# EAGLE design io (EAGLE 4.16)
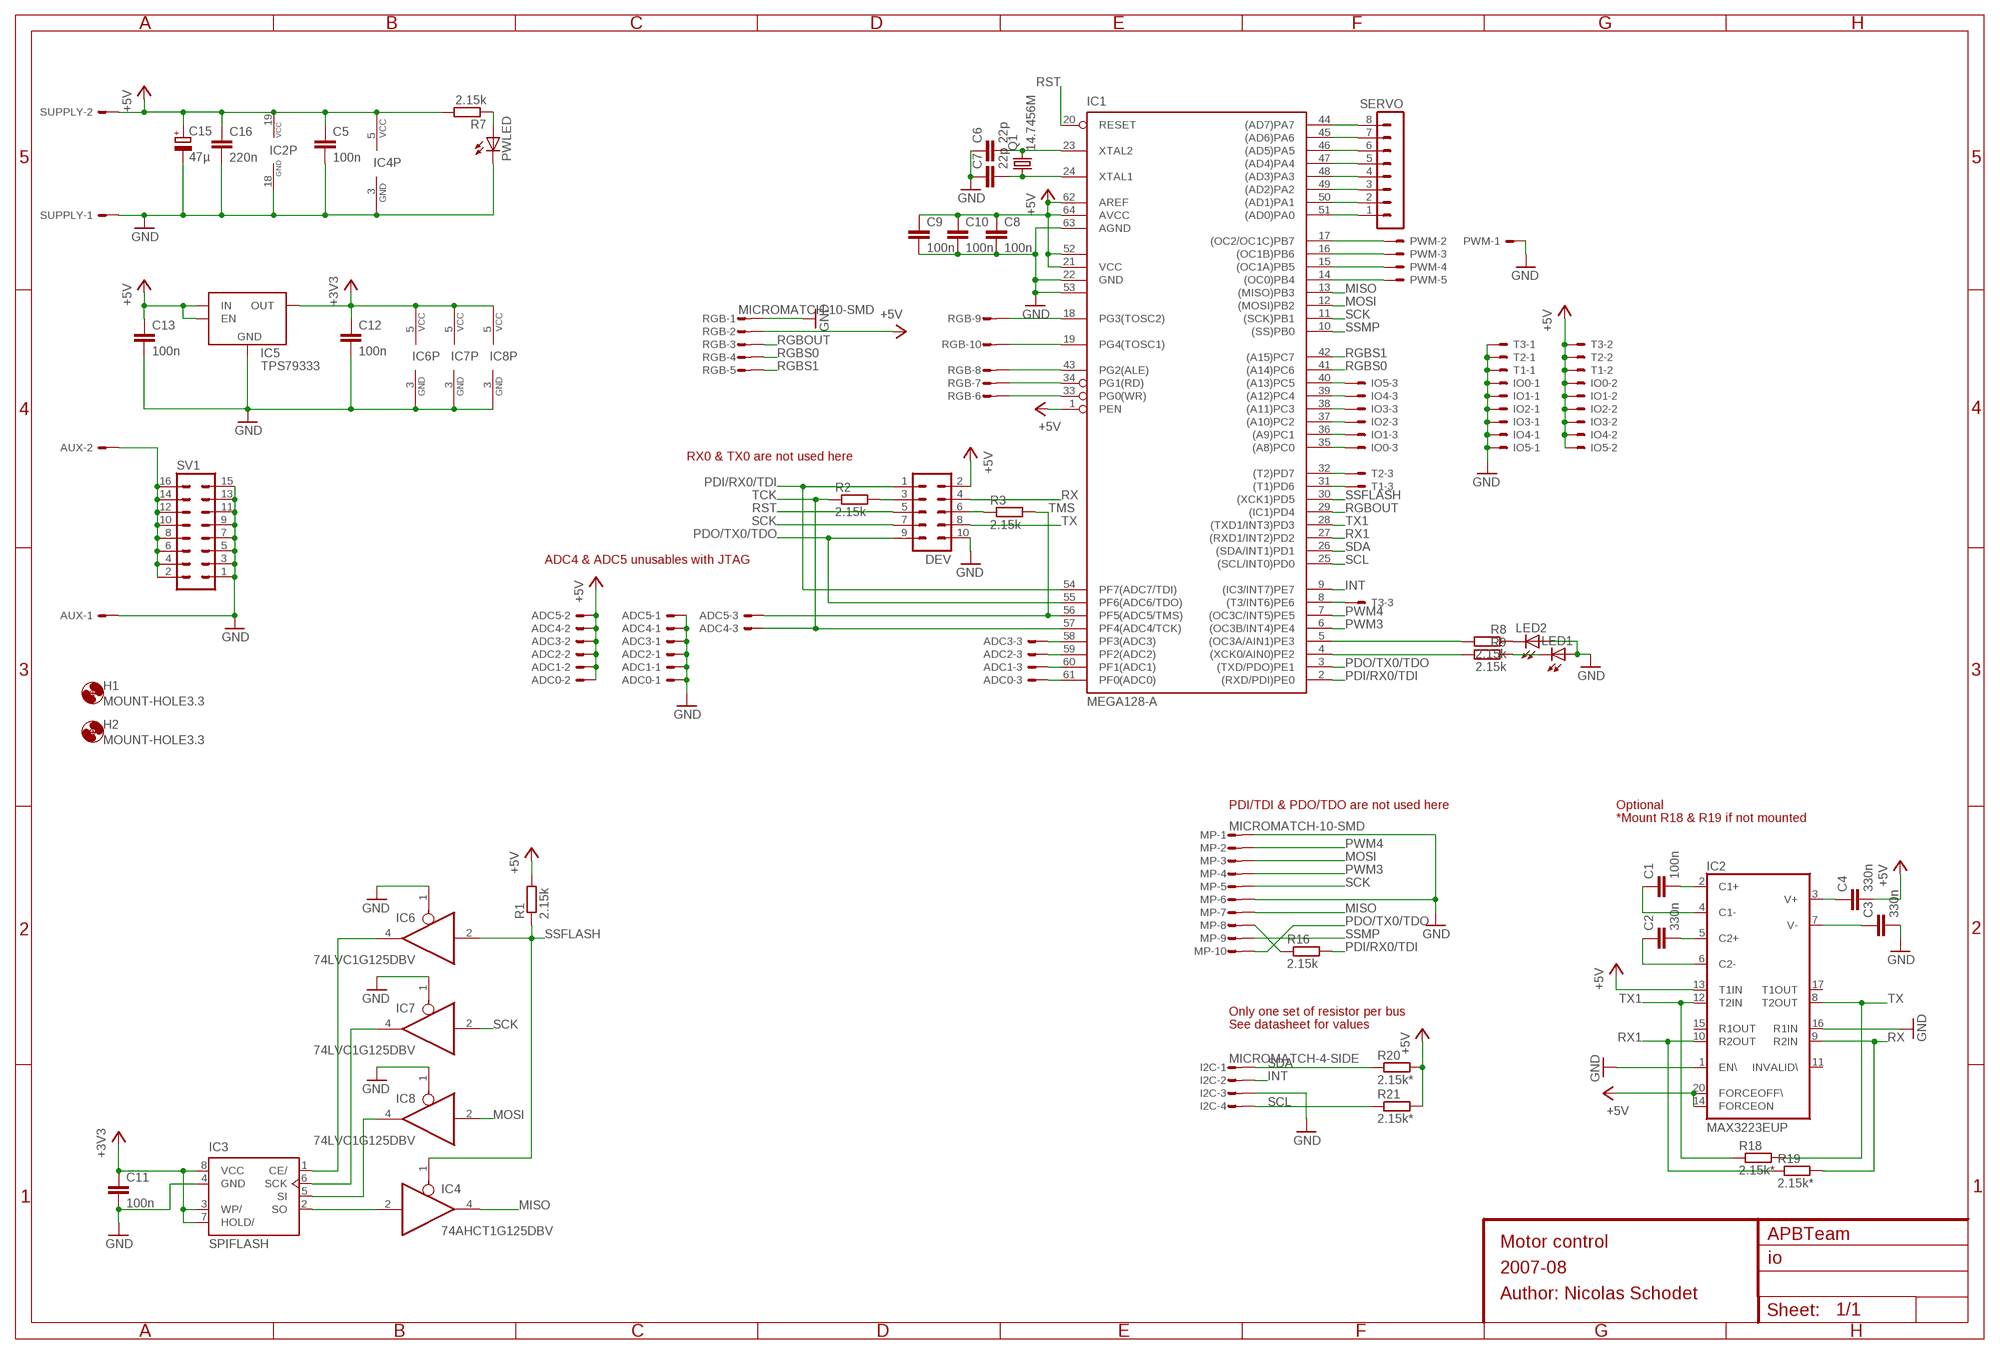
[diagram p0: schematic, sheet 1]

## Parts
ADC0  ED1X03  [ED1X03]
ADC1  ED1X03  [ED1X03]
ADC2  ED1X03  [ED1X03]
ADC3  ED1X03  [ED1X03]
ADC4  ED1X03  [ED1X03]
ADC5  ED1X03  [ED1X03]
AUX  EC1X02  [EC1X02]
C1  100n  C-EUC0603  [C0603]
C2  330n  C-EUC0603  [C0603]
C3  330n  C-EUC0603  [C0603]
C4  330n  C-EUC0603  [C0603]
C5  100n  C-EUC0603  [C0603]
C6  22p  C-EUC0603  [C0603]
C7  22p  C-EUC0603  [C0603]
C8  100n  C-EUC0603  [C0603]
C9  100n  C-EUC0603  [C0603]
C10  100n  C-EUC0603  [C0603]
C11  100n  C-EUC0603  [C0603]
C12  100n  C-EUC0603  [C0603]
C13  100n  C-EUC0603  [C0603]
C15  47µ  CPOL-EUC  [PANASONIC_C]
C16  220n  C-EUC0603  [C0603]
DEV  ML10L  [ML10L]
H1  MOUNT-HOLE3.3  [3,3]
H2  MOUNT-HOLE3.3  [3,3]
I2C  MICROMATCH-4-SIDE  [MICROMATCH-4-SIDE]
IC1  MEGA128-A  [TQFP64]
IC2  MAX3223EUP  [TSSOP20]
IC3  SPIFLASH  [SOIC8]
IC4  74AHCT1G125DBV  [SOT23-5]
IC5  TPS79333  [SOT23-5]
IC6  74LVC1G125DBV  [SOT23-5]
IC7  74LVC1G125DBV  [SOT23-5]
IC8  74LVC1G125DBV  [SOT23-5]
IO0  ED1X03  [ED1X03]
IO1  ED1X03  [ED1X03]
IO2  ED1X03  [ED1X03]
IO3  ED1X03  [ED1X03]
IO4  ED1X03  [ED1X03]
IO5  ED1X03  [ED1X03]
LED1  LEDSMT1206  [1206]
LED2  LEDSMT1206  [1206]
MP  MICROMATCH-10-SMD  [MICROMATCH-10-SMD]
PWLED  LEDSMT1206  [1206]
PWM  ED1X05  [ED1X05]
Q1  14.7456M  CRYTALHC49U70  [HC49U70]
R1  2.15k  R-EU_R0603  [R0603]
R2  2.15k  R-EU_R0603  [R0603]
R3  2.15k  R-EU_R0603  [R0603]
R7  2.15k  R-EU_R0603  [R0603]
R8  2.15k  R-EU_R0603  [R0603]
R9  2.15k  R-EU_R0603  [R0603]
R16  2.15k  R-EU_R0603  [R0603]
R18  2.15k*  R-EU_R0603  [R0603]
R19  2.15k*  R-EU_R0603  [R0603]
R20  2.15k*  R-EU_R0603  [R0603]
R21  2.15k*  R-EU_R0603  [R0603]
RGB  MICROMATCH-10-SMD  [MICROMATCH-10-SMD]
SERVO  MA08-1  [MA08-1]
SUPPLY  EC1X02  [EC1X02]
SV1  MA08-2  [MA08-2]
T1  ED1X03  [ED1X03]
T2  ED1X03  [ED1X03]
T3  ED1X03  [ED1X03]

## Nets
5VS: AUX.2 SV1.2 SV1.4 SV1.6 SV1.8 SV1.10 SV1.12 SV1.14 SV1.16
+3V3 [supply]: C11.1 C12.1 IC3.3(WP/) IC3.7(HOLD/) IC3.8(VCC) IC5.5(OUT) IC6.5(VCC) IC7.5(VCC) IC8.5(VCC)
+5V [supply]: ADC0.2 ADC1.2 ADC2.2 ADC3.2 ADC4.2 ADC5.2 C4.2 C5.1 C8.1 C9.1 C10.1 C13.1 C15.+ C16.1 DEV.2 IC1.1(PEN) IC1.21(VCC) IC1.52(VCC1) IC1.62(AREF) IC1.64(AVCC) IC2.13(T1IN) IC2.14(FORCEON) IC2.19(VCC) IC2.20(FORCEOFF\) IC4.5(VCC) IC5.1(IN) IC5.3(EN) IO0.2 IO1.2 IO2.2 IO3.2 IO4.2 IO5.2 R1.2 R7.2 R20.2 R21.2 RGB.2 SUPPLY.2 T1.2 T2.2 T3.2
AVRCLK: C6.2 IC1.23(XTAL2) Q1.2
GND [supply]: ADC0.1 ADC1.1 ADC2.1 ADC3.1 ADC4.1 ADC5.1 AUX.1 C3.2 C5.2 C6.1 C7.1 C8.2 C9.2 C10.2 C11.2 C12.2 C13.2 C15.- C16.2 DEV.10 I2C.3 IC1.22(GND) IC1.53(GND1) IC1.63(AGND) IC2.1(EN\) IC2.16(R1IN) IC2.18(GND) IC3.4(GND) IC4.3(GND) IC5.2(GND) IC6.1(OE) IC6.3(GND) IC7.1(OE) IC7.3(GND) IC8.1(OE) IC8.3(GND) IO0.1 IO1.1 IO2.1 IO3.1 IO4.1 IO5.1 LED1.A LED2.A MP.1 MP.6 PWLED.C PWM.1 RGB.1 SUPPLY.1 SV1.1 SV1.3 SV1.5 SV1.7 SV1.9 SV1.11 SV1.13 SV1.15 T1.1 T2.1 T3.1
INT: I2C.2 IC1.9((IC3/INT7)PE7)
IO0: IC1.35((A8)PC0) IO0.3
IO1: IC1.36((A9)PC1) IO1.3
IO2: IC1.37((A10)PC2) IO2.3
IO3: IC1.38((A11)PC3) IO3.3
IO4: IC1.39((A12)PC4) IO4.3
IO5: IC1.40((A13)PC5) IO5.3
MC1+: C1.2 IC2.2(C1+)
MC1-: C1.1 IC2.4(C1-)
MC2+: C2.2 IC2.5(C2+)
MC2-: C2.1 IC2.6(C2-)
MISO: IC1.13((MISO)PB3) IC4.4(O) MP.7
MOSI: IC1.12((MOSI)PB2) IC8.2(I) MP.3
MV+: C4.1 IC2.3(V+)
MV-: C3.1 IC2.7(V-)
N$1: PWLED.A R7.1
N$4: IC1.17((OC2/OC1C)PB7) PWM.2
N$5: IC1.16((OC1B)PB6) PWM.3
N$6: IC1.15((OC1A)PB5) PWM.4
N$7: IC1.14((OC0)PB4) PWM.5
N$8: ADC0.3 IC1.61(PF0(ADC0))
N$9: ADC1.3 IC1.60(PF1(ADC1))
N$10: ADC2.3 IC1.59(PF2(ADC2))
N$11: C7.2 IC1.24(XTAL1) Q1.1
N$12: ADC3.3 IC1.58(PF3(ADC3))
N$13: DEV.3 R2.2
N$14: LED2.C R8.1
N$15: IC1.51((AD0)PA0) SERVO.1
N$16: LED1.C R9.1
N$17: IC1.50((AD1)PA1) SERVO.2
N$18: IC1.49((AD2)PA2) SERVO.3
N$19: IC1.48((AD3)PA3) SERVO.4
N$20: IC1.47((AD4)PA4) SERVO.5
N$21: IC1.46((AD5)PA5) SERVO.6
N$22: IC1.45((AD6)PA6) SERVO.7
N$23: IC1.44((AD7)PA7) SERVO.8
N$24: IC3.2(SO) IC4.2(I)
N$25: IC3.5(SI) IC8.4(O)
N$26: IC3.6(SCK) IC7.4(O)
N$27: IC3.1(CE/) IC6.4(O)
N$28: DEV.6 R3.1
N$29: IC1.5((OC3A/AIN1)PE3) R8.2
N$30: IC1.4((XCK0/AIN0)PE2) R9.2
PDI/RX0/TDI: DEV.1 IC1.2((RXD/PDI)PE0) IC1.54(PF7(ADC7/TDI)) R16.2
PDO/TX0/TDO: DEV.9 IC1.3((TXD/PDO)PE1) IC1.55(PF6(ADC6/TDO)) MP.10
PWM3: IC1.6((OC3B/INT4)PE4) MP.4
PWM4: IC1.7((OC3C/INT5)PE5) MP.2
RGBEN0: IC1.33(PG0(WR)) RGB.6
RGBEN1: IC1.34(PG1(RD)) RGB.7
RGBEN2: IC1.43(PG2(ALE)) RGB.8
RGBEN3: IC1.18(PG3(TOSC2)) RGB.9
RGBEN4: IC1.19(PG4(TOSC1)) RGB.10
RGBOUT: IC1.29((IC1)PD4) RGB.3
RGBS0: IC1.41((A14)PC6) RGB.4
RGBS1: IC1.42((A15)PC7) RGB.5
RST: DEV.5 IC1.20(RESET)
RX: DEV.4 IC2.9(R2IN) R19.2
RX1: IC1.27((RXD1/INT2)PD2) IC2.10(R2OUT) R19.1
SCK: DEV.7 IC1.11((SCK)PB1) IC7.2(I) MP.5
SCL: I2C.4 IC1.25((SCL/INT0)PD0) R21.1
SDA: I2C.1 IC1.26((SDA/INT1)PD1) R20.1
SSFLASH: IC1.30((XCK1)PD5) IC4.1(OE) IC6.2(I) R1.1
SSMP: IC1.10((SS)PB0) MP.9
T1: IC1.31((T1)PD6) T1.3
T2: IC1.32((T2)PD7) T2.3
T3: IC1.8((T3/INT6)PE6) T3.3
TCK: ADC4.3 IC1.57(PF4(ADC4/TCK)) R2.1
TMS: ADC5.3 IC1.56(PF5(ADC5/TMS)) R3.2
TX: DEV.8 IC2.8(T2OUT) R18.2
TX1: IC1.28((TXD1/INT3)PD3) IC2.12(T2IN) R18.1
TX_SLAVE: MP.8 R16.1
Unconnected: IC2.11(INVALID\) IC2.15(R1OUT) IC2.17(T1OUT)

## Notes on the sheet
- RX0 & TX0 are not used here
- ADC4 & ADC5 unusables with JTAG
- PDI/TDI & PDO/TDO are not used here | Optional
- *Mount R18 & R19 if not mounted
- Only one set of resistor per bus
- See datasheet for values
- APBTeam
- Motor control
- 2007-08
- Author: Nicolas Schodet

## Library data of the parts
ADC0 ADC1-ADC5 IO0 IO1-IO5 T1-T3 = apbteam_con-amp-he14:E?1X03: Male header simple row, 3 positions
AUX SUPPLY = apbteam_con-amp-he14:E?1X02: Male header simple row, 2 positions
C1-C13 C16 = rcl:C-EU: CAPACITOR, European symbol
C15 = rcl:CPOL-EU: POLARIZED CAPACITOR, European symbol
DEV = con-harting-ml:ML10: HARTING
H1 H2 = holes:MOUNT-HOLE: MOUNTING HOLE with drill center marker
I2C = apbteam_con-amp-micromatch:MICROMATCH-4: MicroMaTch 4
IC1 = robot_avr:MEGA128: MICROCONTROLLER 128 Kbytes FLASH 4 Kbytes SRAM 4 Kbytes EEPROM DUAL USART 8-channel 10 bit ADC
IC2 = maxim:MAX3223*: RS-232 Transceivers with AutoShutdown 1µA Supply-Current, True +3V to +5.5V http://dbserv.maxim-ic.com/
IC3 = apbteam_spiflash:SPIFLASH
IC4 IC6-IC8 = 74xx-little-us:74*1G125: Single Bus Buffer Gate with 3-State Output
IC5 = apbteam_v-reg:TPS793*: Low-power 150 mA low-dropout linear regulator TPS763xx familly
LED1 LED2 PWLED = led:LED: LED OSRAM: - CHIPLED LG R971, LG N971, LY N971, LG Q971, LY Q971, LO R971, LY R971 LH N974, LH R974 LS Q976, LO Q976, LY Q976 LO Q996 - Hyper CHIPLED LW Q18S LB Q993, LB Q99A, LB R99A - SideLED LS A670, LO A670, LY A670, LG A670, LP A670 LB A673, LV A673, LT A673, LW A673 LH A674 LY A675 LS A676, LA A676, LO A676, LY A676, LW A676 LS A679, LY A679, LG A679 - Hyper Micro SIDELED® LS Y876, LA Y876, LO Y876, LY Y876 LT Y87S - SmartLED LW L88C, LW L88S LB L89C, LB L89S, LG L890 LS L89K, LO L89K, LY L89K LS L896, LA L896, LO L896, LY L896 - TOPLED LS T670, LO T670, LY T670, LG T670, LP T670 LSG T670, LSP T670, LSY T670, LOP T670, LYG T670 LG T671, LOG T671, LSG T671 LB T673, LV T673, LT T673, LW T673 LH T674 LS T676, LA T676, LO T676, LY T676, LB T676, LH T676, LSB T676, LW T676 LB T67C, LV T67C, LT T67C, LS T67K, LO T67K, LY T67K, LW E67C LS E67B, LA E67B, LO E67B, LY E67B, LB E67C, LV E67C, LT E67C LW T67C LS T679, LY T679, LG T679 LS T770, LO T770, LY T770, LG T770, LP T770 LB T773, LV T773, LT T773, LW T773 LH T774 LS E675, LA E675, LY E675, LS T675 LS T776, LA T776, LO T776, LY T776, LB T776 LHGB T686 LT T68C, LB T68C - Hyper Mini TOPLED® LB M676 - Mini TOPLED Santana® LG M470 LS M47K, LO M47K, LY M47K Source: http://www.osram.convergy.de/
MP RGB = apbteam_con-amp-micromatch:MICROMATCH-10: MicroMaTch 10
PWM = apbteam_con-amp-he14:E?1X05: Male header simple row, 5 positions
Q1 = crystal:CRYTAL: CRYSTAL
R1-R3 R7-R9 R16 R18-R21 = rcl:R-EU_: RESISTOR, European symbol
SERVO = con-lstb:MA08-1: PIN HEADER
SV1 = con-lstb:MA08-2: PIN HEADER

## Net classes
1 supply: width 0.254 mm

## Board
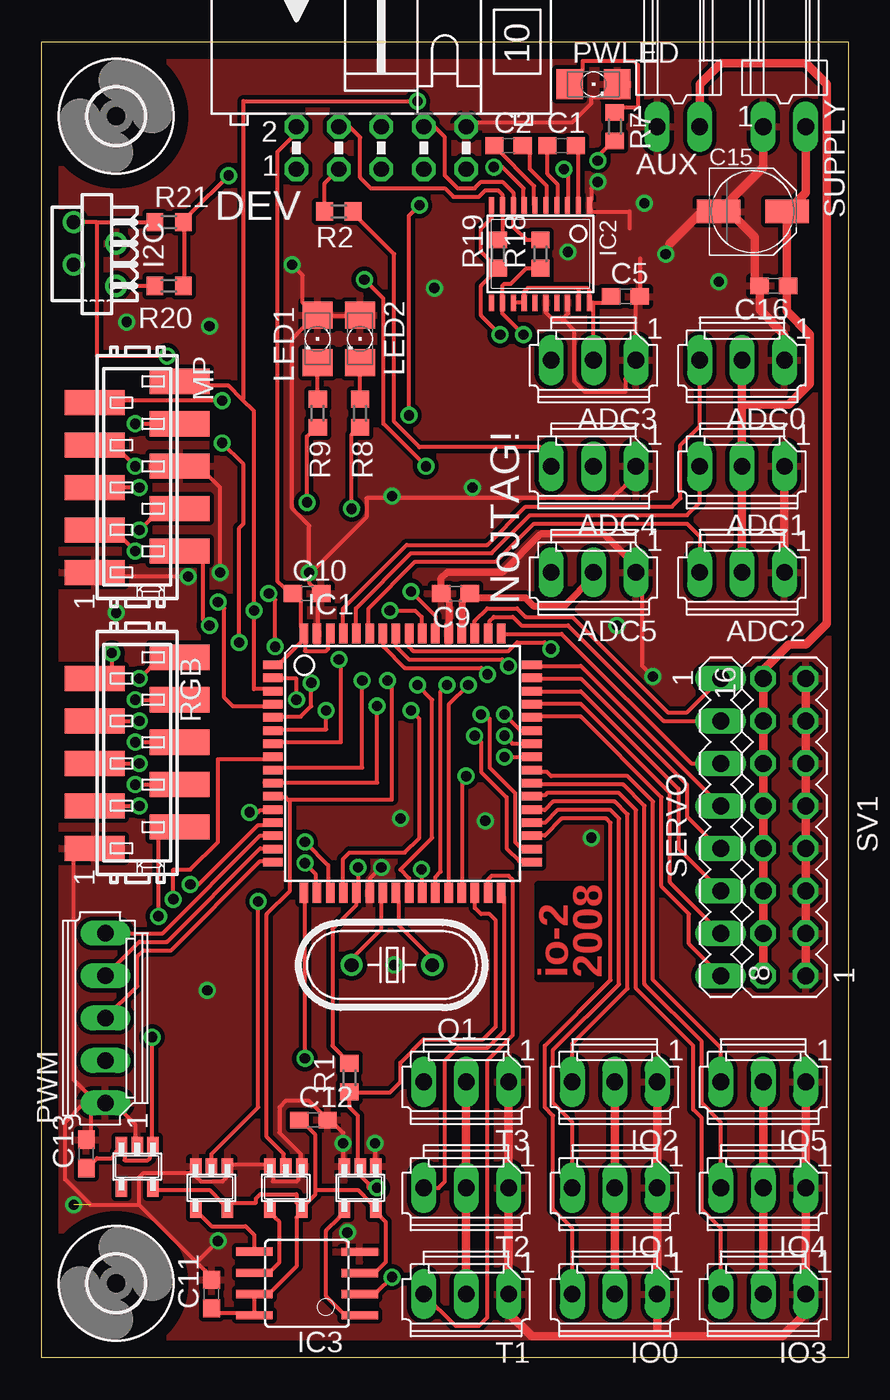
[diagram p1: board, top side]
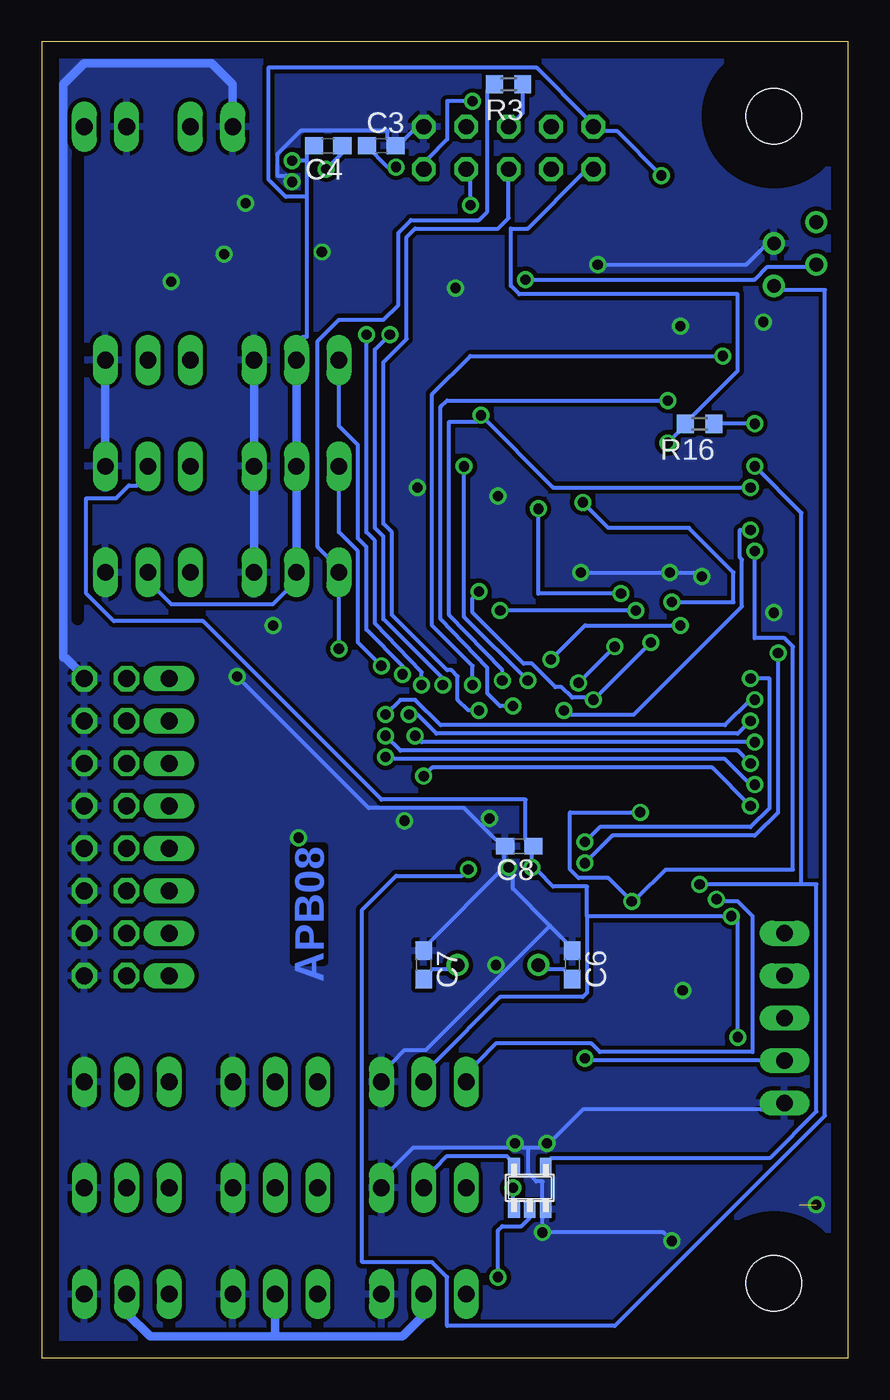
[diagram p2: board, bottom side, seen from below]

Size 48.26 x 78.74 mm. Coordinates in mm from the lower left corner, seen from the top.
Outline: 0,0 0,78.74 48.26,78.74 48.26,0 0,0
Copper layers (1*16): Top 0.035mm / dielectric 1.5mm / Bottom 0.035mm
Design rules "10mils": minimum track width 10mil, minimum drill 24mil, track to track 10mil, track to pad 10mil, pad to pad 10mil, via to via 10mil, smd to smd 10mil, copper to edge 40mil, drill to drill 10mil, minimum pad ring 10mil, minimum via ring 8mil, stop-mask expansion 0mil, vias tented up to drill 0mil, thermal gap 10mil
bRestrict: 1 lines

### Footprints (pad centres in the part's own frame; a part is rotated, then mirrored left to right if it is on the bottom)
ED1X03 = drill 1 long: 1 -2.54,0; 2 0,0; 3 2.54,0
EC1X02 = drill 1 long: 1 -1.27,0; 2 1.27,0
C0603 = smd 1.1 x 1: 1 -0.85,0; 2 0.85,0
PANASONIC_C = smd 2.6 x 1.4: + 2.05,0; - -2.05,0
ML10L = drill 0.914 octagon: 1 -5.08,-1.27; 2 -5.08,1.27; 3 -2.54,-1.27; 4 -2.54,1.27; 5 0,-1.27; 6 0,1.27; 7 2.54,-1.27; 8 2.54,1.27; 9 5.08,-1.27; 10 5.08,1.27
3,3 = hole 3.3: 0,0
MICROMATCH-4-SIDE = drill 0.813 round: 1 1.905,1.27; 2 0.635,-1.27; 3 -0.635,1.27; 4 -1.905,-1.27
TQFP64 = smd 1.194 x 0.508: 1 -7.76,5.905; 2 -7.76,5.118; 3 -7.76,4.331; 4 -7.76,3.543; 5 -7.76,2.756; 6 -7.76,1.968; 7 -7.76,1.181; 8 -7.76,0.394; 9 -7.76,-0.394; 10 -7.76,-1.181; 11 -7.76,-1.968; 12 -7.76,-2.756; 13 -7.76,-3.543; 14 -7.76,-4.331; 15 -7.76,-5.118; 16 -7.76,-5.905; 33 7.76,-5.905; 34 7.76,-5.118; 35 7.76,-4.331; 36 7.76,-3.543; 37 7.76,-2.756; 38 7.76,-1.968; 39 7.76,-1.181; 40 7.76,-0.394; 41 7.76,0.394; 42 7.76,1.181; 43 7.76,1.968; 44 7.76,2.756; 45 7.76,3.543; 46 7.76,4.331; 47 7.76,5.118; 48 7.76,5.905 | smd 0.508 x 1.194: 17 -5.905,-7.76; 18 -5.118,-7.76; 19 -4.331,-7.76; 20 -3.543,-7.76; 21 -2.756,-7.76; 22 -1.968,-7.76; 23 -1.181,-7.76; 24 -0.394,-7.76; 25 0.394,-7.76; 26 1.181,-7.76; 27 1.968,-7.76; 28 2.756,-7.76; 29 3.543,-7.76; 30 4.331,-7.76; 31 5.118,-7.76; 32 5.905,-7.76; 49 5.905,7.76; 50 5.118,7.76; 51 4.331,7.76; 52 3.543,7.76; 53 2.756,7.76; 54 1.968,7.76; 55 1.181,7.76; 56 0.394,7.76; 57 -0.394,7.76; 58 -1.181,7.76; 59 -1.968,7.76; 60 -2.756,7.76; 61 -3.543,7.76; 62 -4.331,7.76; 63 -5.118,7.76; 64 -5.905,7.76
TSSOP20 = smd 0.305 x 0.991: 1 -2.925,-2.918; 2 -2.275,-2.918; 3 -1.625,-2.918; 4 -0.975,-2.918; 5 -0.325,-2.918; 6 0.325,-2.918; 7 0.975,-2.918; 8 1.625,-2.918; 9 2.275,-2.918; 10 2.925,-2.918; 11 2.925,2.918; 12 2.275,2.918; 13 1.625,2.918; 14 0.975,2.918; 15 0.325,2.918; 16 -0.325,2.918; 17 -0.975,2.918; 18 -1.625,2.918; 19 -2.275,2.918; 20 -2.925,2.918
SOIC8 = smd 0.5 x 2.2: 1 -1.905,-3.154; 2 -0.645,-3.154; 3 0.625,-3.154; 4 1.895,-3.154; 5 1.905,3.154; 6 0.635,3.154; 7 -0.635,3.154; 8 -1.905,3.154
SOT23-5 = smd 0.69 x 0.99: 1 -0.95,-1.29; 2 0,-1.29; 3 0.95,-1.29; 4 0.95,1.3; 5 -0.95,1.3
1206 = smd 1.6 x 1.803: A -1.422,0; C 1.422,0
MICROMATCH-10-SMD = smd 1.5 x 3.58: 1 5.715,-2.54; 2 4.445,2.54; 3 3.175,-2.54; 4 1.905,2.54; 5 0.635,-2.54; 6 -0.635,2.54; 7 -1.905,-2.54; 8 -3.175,2.54; 9 -4.445,-2.54; 10 -5.715,2.54
ED1X05 = drill 1 long: 1 -5.08,0; 2 -2.54,0; 3 0,0; 4 2.54,0; 5 5.08,0
HC49U70 = drill 0.813 round: 1 -2.413,0; 2 2.413,0
R0603 = smd 1 x 1.1: 1 -0.85,0; 2 0.85,0
MA08-1 = drill 1.016 long: 1 -8.89,0; 2 -6.35,0; 3 -3.81,0; 4 -1.27,0; 5 1.27,0; 6 3.81,0; 7 6.35,0; 8 8.89,0
MA08-2 = drill 1.016 octagon: 1 -8.89,-1.27; 2 -8.89,1.27; 3 -6.35,-1.27; 4 -6.35,1.27; 5 -3.81,-1.27; 6 -3.81,1.27; 7 -1.27,-1.27; 8 -1.27,1.27; 9 1.27,-1.27; 10 1.27,1.27; 11 3.81,-1.27; 12 3.81,1.27; 13 6.35,-1.27; 14 6.35,1.27; 15 8.89,-1.27; 16 8.89,1.27

### Placement (x,y rotation side)
ADC0  41.91,59.69 180 top
ADC1  41.91,53.34 180 top
ADC2  41.91,46.99 180 top
ADC3  33.02,59.69 180 top
ADC4  33.02,53.34 180 top
ADC5  33.02,46.99 180 top
AUX  38.1,73.66 0 top
C1  31.11,72.52 0 top
C2  27.94,72.52 0 top
C3  27.94,72.52 0 bottom
C4  31.11,72.52 180 bottom
C5  34.92,63.5 0 top
C6  16.51,23.5 270 bottom
C7  25.4,23.5 270 bottom
C8  19.68,30.61 180 bottom
C9  24.77,45.72 180 top
C10  15.88,45.72 0 top
C11  10.16,3.81 90 top
C12  16.26,14.22 0 top
C13  2.67,12.19 90 top
C15  42.55,68.58 0 top
C16  43.81,64.14 180 top
DEV  20.32,72.39 0 top
H1  4.45,74.3 0 top
H2  4.45,4.45 0 top
I2C  3.17,66.04 270 top
IC1  21.59,35.56 0 top
IC2  29.84,66.04 180 top
IC3  15.88,4.45 90 top
IC4  19.05,10.16 0 bottom
IC5  5.71,11.43 180 top
IC6  19.05,10.16 180 top
IC7  14.61,10.16 180 top
IC8  10.16,10.16 180 top
IO0  34.29,3.81 180 top
IO1  34.29,10.16 180 top
IO2  34.29,16.51 180 top
IO3  43.18,3.81 180 top
IO4  43.18,10.16 180 top
IO5  43.18,16.51 180 top
LED1  16.51,60.96 270 top
LED2  19.05,60.96 270 top
MP  5.71,52.7 270 top
PWLED  33.02,76.2 0 top
PWM  3.81,20.32 90 top
Q1  20.95,23.5 180 top
R1  18.41,16.76 90 top
R2  17.78,68.58 180 top
R3  20.32,76.2 180 bottom
R7  34.29,73.66 270 top
R8  19.05,56.52 270 top
R9  16.51,56.52 270 top
R16  8.89,55.88 180 bottom
R18  29.84,66.04 90 top
R19  27.3,66.04 90 top
R20  7.62,64.14 0 top
R21  7.62,67.94 0 top
RGB  5.71,36.2 270 top
SERVO  40.64,31.75 270 top
SUPPLY  44.45,73.66 0 top
SV1  44.45,31.75 90 top
T1  25.4,3.81 180 top
T2  25.4,10.16 180 top
T3  25.4,16.51 180 top

### Tracks (layer width: path | path; a pad name or v marks a point on that pad's centre or on a via)
5VS
  Top 0.508: AUX.2 39.37,76.2 40.64,77.47 45.72,77.47 46.99,76.2 46.99,43.94 45.72,42.67 44.7,42.67 43.18,41.15 SV1.16 SV1.14 SV1.12 SV1.10 SV1.8 SV1.6 SV1.4 SV1.2
+3V3
  Top 0.254: C11.1 10.54,2.67 11.68,2.67 IC3.8 12.7,2.67 12.7,3.68 IC3.7 13.72,3.94 15.24,5.46 15.24,8.38 IC7.5 | IC3.3 20.07,5.21 20.57,5.71 20.57,8.13 20.32,8.38 IC6.5 19.68,9.27 18.92,10.03 16.38,10.03 | IC5.5 6.99,10.03 10.03,10.03 10.79,9.27 IC8.5 11.43,9.27 12.83,9.27 12.83,9.53 13.08,9.78 15.24,9.78 15.24,9.27 IC7.5 | 16.38,10.03 16.38,9.78 15.88,9.27 IC7.5 | C12.1 15.49,14.22 16.38,13.34 16.38,10.03
+5V  (via drill 0.61)
  Top 0.254: v18.92,29.34 18.92,27.89 IC1.21 18.8,27.3 18.8,27.05 17.4,25.65 17.4,18.67 R1.2 | IC2.13 28.83,63.12 IC2.14 28.87,63.8 29.08,64.01 32.13,64.01 | IC2.19 32.12,63.23 32.13,63.25 32.13,64.01 | 32.13,64.01 32.64,64.01 32.77,63.88 IC2.20 33.02,63.12 | C5.1 34.04,63.5 33.66,63.12 33.02,63.12 | 33.02,63.12 IC2.20 | ADC3.2 33.02,63.12 | 4.45,12.32 IC5.3 4.95,12.32 4.95,11.81 6.35,11.81 6.48,11.94 6.48,12.32 IC5.1 6.6,13.21 v6.6,19.18 | v6.99,26.42 6.99,31.11 RGB.2 | v33.27,71.63 33.27,71.88 33.78,72.39 R7.2 | IC1.64 15.49,43.81 15.49,45.34 C10.1 14.48,46.1 14.1,46.48 14.1,72.14 14.99,73.03 DEV.2 | IC1.1 14.35,41.66 15.49,42.8 IC1.64 | IC1.62 17.14,42.8 17.14,42.42 17.02,42.29 15.75,42.29 15.75,42.8 IC1.64 | R20.2 8.51,64.64 8.51,67.44 R21.2 8.89,68.45 v11.18,70.74 | C13.1 2.79,11.34 2.79,11.05 | 2.79,11.43 3.3,11.94 4.19,11.94 4.83,12.57
  Top 0.406: IC1.52 25.15,43.31 25.15,45.25 C9.1 | ADC5.2 33.02,46.74 31.24,44.96 29.46,44.96 28.96,45.47 25.91,45.47 25.65,45.72 | 2.79,11.34 2.79,11.43 | 4.83,12.57 4.76,12.63 IC5.3
  Top 0.508: SUPPLY.2 45.72,69.72 44.58,68.58 C15.+ 44.59,64.15 44.58,64.14 | 44.58,64.14 C16.1 44.83,64.14 | IO5.2 IO4.2 IO3.2 | IO0.2 IO1.2 IO2.2 | T3.2 T2.2 T1.2 | 44.58,64.14 44.58,62.61 45.97,61.21 45.97,58.29 44.7,57.02 41.91,57.02 | 41.91,57.02 ADC0.2 | ADC2.2 ADC1.2 41.91,57.02 | 25.65,45.72 C9.1
  Bottom 0.254: IC4.5 20.32,11.94 20.45,12.06 24,12.06 24.77,11.3 T2.2 | 15.62,26.42 15.62,28.19 17.65,28.19 18.54,29.08 v18.92,29.34 18.92,30.39 C8.1 19.3,30.99 19.3,33.4 27.94,33.4 38.61,44.07 43.94,44.07 45.59,45.72 45.59,51.44 43.81,51.44 43.05,52.2 42.55,52.2 ADC1.2 | 15.62,26.42 15.62,21.84 15.88,21.59 20.83,21.59 24.77,17.65 T3.2 | 15.62,26.42 v6.99,26.42 6.6,26.16 v6.6,19.18 | 32.38,69.47 32.38,61.09 32.64,61.09 ADC3.2 | 32.38,69.47 32.38,71.63 | 32.38,71.63 32.38,72.14 C4.2 | 32.38,71.63 v33.27,71.63 | ADC5.2 33.66,45.85 34.42,45.09 40.51,45.09 41.27,45.85 ADC2.2 | v11.18,70.74 13.84,73.41 14.61,73.41 DEV.2 15.62,74.17 18.67,77.22 34.67,77.22 34.67,70.48 33.66,69.47 32.38,69.47
  Bottom 0.508: ADC3.2 ADC4.2 ADC5.2 | IO3.2 43.18,2.67 41.78,1.27 34.29,1.27 | 34.29,1.27 IO0.2 | T1.2 25.4,2.54 26.67,1.27 34.29,1.27
AVRCLK
  Top 0.254: IC1.23 20.32,27.3 20.32,25.65 18.8,24.13 Q1.2
  Bottom 0.254: C6.2 16.89,23.11 17.02,23.24 17.91,23.24 Q1.2
GND  (via drill 0.61)  (1 unrouted)
  Top 0.254: 19.05,6.35 IC3.4 18.29,6.48 v18.29,7.49 | IC1.22 19.62,28.64 v20.32,29.34 | IC2.16 30.17,62.54 30.61,62.1 31.11,62.1 31.18,62.17 | IC2.18 31.5,63.12 31.5,62.48 31.18,62.17 | IC6.3 18.03,11.94 v18.03,12.83 18.03,13.46 17.27,14.22 17.14,14.22 | v19.94,12.83 19.94,11.94 IC6.1 | IC7.1 15.37,11.05 15.37,10.67 15.24,10.54 13.84,10.54 13.84,11.05 IC7.3 13.34,11.56 11.43,11.56 IC8.1 11.11,11.36 11.05,11.3 11.05,10.79 10.79,10.54 9.53,10.54 9.21,10.86 IC8.3 8.89,11.05 6.1,11.05 5.84,10.79 5.84,9.14 | 5.84,9.14 9.27,5.71 | 9.27,5.71 9.78,5.21 C11.2 | IC5.2 5.59,13.21 5.59,13.97 4.95,14.61 PWM.1 | RGB.1 1.91,29.84 1.91,16.64 2.67,15.88 PWM.1 | PWLED.C 33.66,75.44 32.89,75.44 32.89,75.06 31.75,73.91 26.04,73.91 DEV.10 | 31.18,62.17 31.88,61.47 31.88,58.42 32.51,57.78 34.92,57.78 34.92,58.55 ADC3.1 35.56,63.12 C5.2 35.81,63.88 35.81,65.79 | 35.18,67.56 35.18,68.58 32.89,68.58 IC2.1 32.89,69.34 32.89,69.98 v33.27,70.36 | IC1.63 16.51,43.81 16.51,45.34 C10.2 16.26,46.1 16,46.35 v16,46.99 | LED1.A 17.4,62.36 18.16,62.36 LED2.A | v16,46.99 16,49.78 14.99,50.8 14.99,60.96 15.62,61.59 LED1.A | v14.99,65.41 15.62,64.77 15.62,63.12 LED1.A | v8.76,46.74 4.95,46.74 MP.1 | v10.67,46.99 10.67,52.07 10.03,52.7 MP.6 | ADC4.1 34.92,52.2 34.16,51.44 19.43,51.44 19.43,50.29 16.38,47.24 v16,46.99 | v36.58,40.77 35.94,41.4 35.94,45.59 ADC5.1 | PWM.1 3.56,15.24 2.92,14.61 2.92,13.21 2.75,13.04 | 17.14,14.22 C12.2 | 5.84,9.14 2.92,9.14 1.4,10.67 1.4,14.1 2.54,15.24 PWM.1 | 17.14,14.22 16,15.37 14.61,15.37 14.22,14.99 14.22,13.46 15.49,12.19 15.49,11.43 | 9.27,5.71 v10.54,6.99
  Top 0.406: IC1.53 24.36,43.31 24.38,43.31 24.38,45.25 C9.2 23.88,45.72 23.88,46.61 24.26,46.99 27.56,46.99 29.84,49.28 33.66,49.28 35.56,47.37 ADC5.1 | 2.75,13.04 C13.2
  Top 0.508: C15.- 40.51,68.58 43.18,71.25 SUPPLY.1 | C15.- 41.15,68.58 42.67,67.06 42.67,64.52 42.97,64.22 C16.2 42.97,62.7 44.45,61.21 ADC0.1 | IO5.1 IO4.1 IO3.1 45.72,2.67 44.32,1.27 36.83,1.27 | IO2.1 IO1.1 IO0.1 36.83,1.27 | T3.1 T2.1 T1.1 27.94,2.67 29.34,1.27 36.83,1.27 | ADC2.1 ADC1.1 | 37.55,66.63 39.5,68.58 C15.- | SV1.15 SV1.13 SV1.11 SV1.9 SV1.7 SV1.5 SV1.3 SV1.1
  Bottom 0.254: v20.32,29.34 20.57,29.59 20.57,30.61 C8.2 21.08,30.99 22.99,32.89 28.7,32.89 v36.58,40.77 | 17.84,25.84 20.07,28.07 20.07,28.96 v20.32,29.34 | 17.84,25.84 16.89,24.89 C6.1 | C7.1 25.02,24.89 20.83,29.08 20.7,29.08 v20.32,29.34 | 19.18,12.57 19.18,11.05 18.67,10.54 18.29,10.54 18.29,9.27 IC4.3 18.29,8.38 v18.29,7.49 11.05,7.49 v10.54,6.99 | 19.94,12.57 26.04,12.57 27.3,11.3 T2.1 | 19.18,12.57 19.94,12.57 | 19.18,12.57 18.29,12.57 v18.03,12.83 17.65,13.08 15.88,14.86 5.21,14.86 PWM.1 | 19.94,12.57 v19.94,12.83 | 17.84,25.84 25.27,18.41 26.54,18.41 27.3,17.65 T3.1 | DEV.10 26.04,73.41 26.54,72.9 C3.2 27.56,72.9 27.56,73.41 32.77,73.41 34.16,72.01 34.16,70.74 33.66,70.74 v33.27,70.36 | v14.99,65.41 6.1,65.41 5.08,66.42 I2C.3 | v8.76,46.74 9.02,46.99 v10.67,46.99 v16,46.99
  Bottom 0.508: ADC1.1 ADC0.1 | ADC5.1 ADC4.1 ADC3.1 | AUX.1 36.83,76.2 38.1,77.47 45.72,77.47 46.99,76.2 46.99,41.91 46.86,41.91 45.72,40.77 SV1.15
  other vias: 20.95,51.56 25.78,52.07 23.5,64.01 21.08,23.5 9.91,21.97 32.89,31.11 26.54,32.13 34.42,43.81 10.03,61.72 5.08,61.98 4.45,44.58 31.5,66.17 40.51,64.39 21.46,32.26 36.07,69.09 37.34,66.04 1.91,9.14
  pour Bottom (isolate 0.254): 0,78.74 48.26,78.74 48.26,0 0,0
  pour Top (isolate 0.254): 0,78.74 48.26,78.74 48.26,0 0,0
INT  (via drill 0.61)
  Top 0.254: v19.18,40.51 19.18,35.31 14.35,35.31 IC1.9 | v22.99,53.34 20.45,55.88 20.45,63.37 v19.3,64.52
  Bottom 0.254: v19.18,40.51 22.99,44.32 v22.99,53.34 | v19.3,64.52 5.59,64.52 4.83,65.28 2.54,65.28 I2C.2
IO0
  Top 0.254: IO0.3 31.75,7.75 30.61,8.89 30.61,14.48 30.1,14.99 30.1,18.67 34.04,22.61 34.04,32 33.78,32.26 31.11,32.26 30.1,31.24 29.34,31.24 IC1.35
IO1
  Top 0.254: IO1.3 31.75,14.1 30.61,15.24 30.61,18.41 34.54,22.35 34.54,32.26 34.04,32.77 30.86,32.77 30.1,32 29.34,32 IC1.36
IO2
  Top 0.254: IO2.3 31.75,18.8 35.05,22.1 35.05,32.51 34.29,33.27 30.61,33.27 30.1,32.77 29.34,32.77 29.35,32.78 IC1.37
IO3
  Top 0.254: IO3.3 40.64,7.75 39.5,8.89 39.5,14.35 38.99,14.86 38.99,18.67 35.56,22.1 35.56,32.77 34.54,33.78 30.23,33.78 30.1,33.66 29.46,33.66 29.4,33.59 IC1.38
IO4
  Top 0.254: IO4.3 40.64,14.1 39.5,15.24 39.5,18.92 36.07,22.35 36.07,33.02 34.8,34.29 29.34,34.29 29.35,34.3 IC1.39
IO5
  Top 0.254: IO5.3 40.64,18.54 36.58,22.61 36.58,33.27 35.05,34.8 30.48,34.8 30.23,35.05 29.46,35.05 IC1.40 | 29.21,35.18 29.22,35.17 IC1.40 | IC1.40 29.34,35.18
MC1+
  Top 0.254: C1.2 32.13,72.35 IC2.2
MC1-
  Top 0.254: C1.1 30.27,70.83 30.86,70.23 30.86,68.96 IC2.4
MC2+
  Top 0.254: C2.2 29.21,72.1 29.21,71.12 30.23,70.1 30.23,68.96 IC2.5
MC2-
  Top 0.254: C2.1 27.18,72.39 29.46,70.1 29.46,68.96 29.47,68.96 IC2.6
MISO  (via drill 0.61)
  Top 0.254: v8.89,28.32 9.4,28.32 12.95,31.88 13.34,31.88 IC1.13 | v5.59,53.34 4.95,53.98 MP.7
  Bottom 0.254: 2.79,28.32 v8.89,28.32 | 2.79,28.32 1.91,28.32 1.91,14.73 4.7,11.94 17.78,11.94 IC4.4 | v5.59,53.34 2.79,50.55 2.79,28.32
MOSI  (via drill 0.61)
  Top 0.254: v12.95,27.3 12.95,14.99 10.16,12.19 IC8.2 | v12.45,32.64 12.95,32.64 13.08,32.77 13.34,32.77 IC1.12 | v5.59,48.26 4.95,48.9 MP.3
  Bottom 0.254: v12.45,32.64 16.64,32.64 16.64,29.21 16.13,28.7 14.35,28.7 v12.95,27.3 12.57,27.56 10.92,29.21 3.3,29.21 3.3,42.55 3.81,43.05 5.59,43.05 v5.59,48.26
MV+  (via drill 0.61)
  Top 0.254: IC2.3 31.5,68.96 31.5,70.87 v31.24,71.12
  Bottom 0.254: C4.1 30.27,72.1 v31.24,71.12
MV-  (via drill 0.61)
  Top 0.254: v27.05,71.25 27.56,71.25 28.83,69.98 28.83,68.96 IC2.7
  Bottom 0.254: C3.1 28.79,72.48 27.56,71.25 v27.05,71.25
N$1
  Top 0.254: R7.1 34.8,74.8 35.69,74.8 35.69,77.34 35.43,77.6 32.38,77.6 32.38,77.09 PWLED.A
N$4  (via drill 0.61)
  Top 0.254: v15.75,17.91 15.75,27.3 IC1.17
  Bottom 0.254: v15.75,17.91 15.62,17.78 PWM.2
N$5
  Top 0.254: PWM.3 5.71,22.23 5.71,24 6.1,24.38 7.75,24.38 13.08,29.72 13.84,29.72 13.83,29.7 IC1.16
N$6
  Top 0.254: PWM.4 5.84,24.89 7.49,24.89 13.08,30.48 13.84,30.48 13.83,30.47 IC1.15
N$7
  Top 0.254: PWM.5 7.24,25.4 13.08,31.24 13.84,31.24 IC1.14
N$8
  Top 0.254: ADC0.3 39.37,55.75 38.23,54.61 38.23,51.44 37.72,50.93 28.96,50.93 26.67,48.64 21.84,48.64 18.03,44.83 18.03,43.43 18.05,43.42 IC1.61
N$9
  Top 0.254: ADC1.3 39.37,51.18 38.61,50.42 29.21,50.42 26.92,48.13 22.1,48.13 18.8,44.83 18.8,43.69 18.83,43.65 IC1.60
N$10
  Top 0.254: ADC2.3 39.37,49.15 38.61,49.91 29.46,49.91 27.18,47.62 22.35,47.62 19.56,44.83 19.56,43.43 19.62,43.5 IC1.59
N$11
  Top 0.254: IC1.24 21.34,27.3 21.34,25.91 23.11,24.13 Q1.1
  Bottom 0.254: C7.2 25.02,23.11 24.89,23.24 24,23.24 Q1.1
N$12  (via drill 0.61)
  Top 0.254: v26.67,40.89 26.29,41.27 21.72,41.27 20.45,42.55 20.45,43.31 20.43,43.32 IC1.58
  Bottom 0.254: ADC3.3 30.48,55.75 29.34,54.61 29.34,49.02 28.83,48.51 28.83,43.56 26.67,41.4 v26.67,40.89
N$13
  Top 0.254: R2.2 16.93,70.27 DEV.3
N$14
  Top 0.254: R8.1 LED2.C
N$15
  Top 0.254: IC1.51 25.91,43.31 25.91,44.07 26.67,44.83 28.45,44.83 28.96,44.32 31.75,44.32 37.47,38.61 38.61,38.61 SERVO.1
N$16
  Top 0.254: R9.1 LED1.C
N$17
  Top 0.254: 26.68,43.32 26.67,43.31 | IC1.50 26.68,43.32 | 26.68,43.32 26.8,43.43 26.8,44.07 27.05,44.32 28.19,44.32 28.7,43.81 31.5,43.81 37.21,38.1 SERVO.2
N$18
  Top 0.254: SERVO.3 38.86,35.56 31.11,43.31 27.43,43.31 27.45,43.32 IC1.49
N$19
  Top 0.254: SERVO.4 32.26,41.4 29.34,41.4 29.35,41.41 IC1.48
N$20
  Top 0.254: SERVO.5 40.51,30.48 38.61,32.38 38.61,34.29 32.26,40.64 29.34,40.64 29.35,40.65 IC1.47
N$21
  Top 0.254: SERVO.6 38.1,30.48 38.1,34.04 32.26,39.88 29.46,39.88 29.45,39.89 IC1.46
N$22
  Top 0.254: SERVO.7 37.59,28.45 37.59,33.78 32.26,39.12 29.34,39.12 IC1.45
N$23
  Top 0.254: SERVO.8 38.73,24.77 38.73,26.54 37.08,28.19 37.08,33.53 32.26,38.35 29.46,38.35 29.35,38.24 | 29.35,38.24 29.34,38.23 | 29.35,38.24 IC1.44
N$24  (via drill 0.61)
  Top 0.254: v20.95,4.83 20.07,3.94 IC3.2
  Bottom 0.254: v20.95,4.83 20.95,7.62 20.7,7.87 19.56,7.87 19.05,8.38 IC4.2
N$25
  Top 0.254: IC8.4 9.27,8.76 10.16,7.87 12.19,7.87 12.72,7.34 IC3.5
N$26
  Top 0.254: IC7.4 13.97,8.38 14.22,8.13 14.22,5.71 13.72,5.21 IC3.6
N$27
  Top 0.254: IC6.4 17.78,8.38 17.02,7.62 17.02,3.68 18.03,2.67 IC3.1
N$28
  Bottom 0.254: R3.1 19.47,74.51 DEV.6
N$29  (via drill 0.61)
  Top 0.254: v18.54,50.8 18.54,55.24 R8.2 | v13.59,45.72 13.97,45.34 v13.97,42.55 | v16.13,40.39 16.13,38.99 15.49,38.35 14.35,38.35 IC1.5
  Bottom 0.254: v18.54,50.8 18.54,45.72 v13.59,45.72 | v16.13,40.39 v13.97,42.55
N$30  (via drill 0.61)
  Top 0.254: v15.88,51.18 15.88,55.12 16,55.24 R9.2 | v10.54,45.21 10.92,44.83 10.92,39.5 11.43,38.99 13.34,38.99 IC1.4
  Bottom 0.254: v15.88,51.18 14.35,49.66 9.53,49.66 6.86,46.99 6.86,45.21 v10.54,45.21
PDI/RX0/TDI  (via drill 0.61)
  Top 0.254: v15.24,39.37 15.24,40.64 14.35,40.64 IC1.2 | v11.81,42.8 11.81,49.66 12.06,49.91 12.06,53.47 v10.79,54.74 | IC1.54 23.56,44.39 v22.1,45.85
  Bottom 0.254: DEV.1 15.88,70.87 19.18,67.56 20.19,67.56 20.19,64.14 19.68,63.63 6.6,63.63 6.6,59.05 9.27,56.39 R16.2 10.16,55.37 v10.79,54.74 | v11.81,42.8 v15.24,39.37 15.37,39.5 16.51,39.5 17.14,40.13 17.53,40.13 18.92,41.53 19.43,41.53 22.48,44.58 22.48,45.47 v22.1,45.85
PDO/TX0/TDO  (via drill 0.61)
  Top 0.254: 12,57.34 11.18,58.17 10.03,58.17 MP.10 | 12,57.34 12.7,56.64 v12.7,44.7 12.7,40.01 13.34,40.01 IC1.3 | v20.83,44.7 22.35,44.7 22.73,44.32 22.73,43.81 IC1.55 | v22.48,75.18 12.06,75.18 12.06,57.4 12,57.34
  Bottom 0.254: v12.7,44.7 v20.83,44.7 | v22.48,75.18 24,75.18 24,72.9 25.15,71.75 DEV.9
PWM3  (via drill 0.61)
  Top 0.254: v17.02,38.73 17.02,37.59 14.35,37.59 IC1.6 | v5.84,49.53 6.48,50.16 MP.4
  Bottom 0.254: v17.02,38.73 16.76,38.48 12.83,38.48 6.35,44.96 6.35,47.75 6.48,47.88 6.48,49.53 v5.84,49.53
PWM4  (via drill 0.61)
  Top 0.254: v17.78,41.78 17.91,41.66 17.91,36.83 14.35,36.83 IC1.7 | v10.03,43.81 9.65,44.2 9.65,47.62 MP.2
  Bottom 0.254: v17.78,41.78 15.75,43.81 v10.03,43.81
RGBEN0  (via drill 0.61)
  Top 0.254: v5.59,36.83 RGB.6 | v25.91,37.21 26.29,36.83 26.29,35.05 27.81,33.53 27.81,30.48 28.57,29.72 29.34,29.72 29.35,29.7 IC1.33
  Bottom 0.254: v5.59,36.83 25.53,36.83 v25.91,37.21
RGBEN1  (via drill 0.61)
  Top 0.254: RGB.7 v5.84,38.1 | v26.29,38.48 26.54,38.48 26.8,38.23 26.8,35.31 28.32,33.78 28.32,30.86 28.7,30.48 29.34,30.48 29.35,30.47 IC1.34
  Bottom 0.254: v5.84,38.1 6.6,37.34 24.64,37.34 25.78,38.48 v26.29,38.48
RGBEN2  (via drill 0.61)
  Top 0.254: v5.59,39.37 RGB.8 | IC1.43 28.64,37.53 v27.69,38.48
  Bottom 0.254: v5.59,39.37 5.84,39.37 7.37,37.85 24.38,37.85 25.91,39.37 26.8,39.37 v27.69,38.48
RGBEN3  (via drill 0.61)
  Top 0.254: v15.75,29.59 16.38,28.96 16.38,28.32 IC1.18 | v4.19,42.16 4.19,41.27 RGB.9
  Bottom 0.254: v15.75,29.59 14.1,31.24 5.59,31.24 4.19,32.64 v4.19,42.16
RGBEN4  (via drill 0.61)
  Top 0.254: v15.75,30.86 17.14,29.46 17.14,28.32 IC1.19 | v5.84,40.64 6.48,41.27 RGB.10
  Bottom 0.254: v15.75,30.86 14.86,31.75 5.84,31.75 4.7,32.89 4.7,40.64 v5.84,40.64
RGBOUT  (via drill 0.61)
  Top 0.254: RGB.3 v5.84,33.02 | IC1.29 25.15,27.81 25.15,34.54 v25.4,34.8
  Bottom 0.254: v5.84,33.02 8.13,35.31 24.89,35.31 v25.4,34.8
RGBS0  (via drill 0.61)
  Top 0.254: v5.59,34.29 RGB.4 | IC1.41 27.7,35.95 v27.69,35.94
  Bottom 0.254: v5.59,34.29 5.84,34.29 7.37,35.81 27.56,35.81 v27.69,35.94
RGBS1  (via drill 0.61)
  Top 0.254: RGB.5 v5.84,35.56 | IC1.42 28.16,36.74 v27.69,37.21
  Bottom 0.254: v5.84,35.56 6.6,36.32 26.8,36.32 v27.69,37.21
RST  (via drill 0.61)
  Top 0.254: IC1.20 18.03,27.81 18.03,29.84 18.41,30.23 21.72,30.23 22.61,31.11 22.61,38.23 v22.1,38.73
  Bottom 0.254: v22.1,38.73 22.73,38.73 23.37,39.37 23.37,40.77 23.75,41.15 24,41.15 27.3,44.45 27.3,49.4 27.81,49.91 27.81,59.56 26.42,60.96 26.42,67.06 25.91,67.56 20.95,67.56 20.32,68.2 DEV.5
RX
  Top 0.254: R19.2 27.3,66.93 27.57,67.19 IC2.9 27.57,69.58 27.3,69.85 26.54,69.85 26.16,69.47 24.64,69.47 24.13,69.98 19.68,69.98 19.05,70.61 19.05,73.03 18.41,73.66 DEV.4
RX1  (via drill 0.61)
  Top 0.254: IC2.10 26.92,68.2 26.29,67.56 26.29,66.17 27.27,65.19 R19.1 27.3,65.15 26.29,64.14 26.29,62.36 v27.43,61.21 | IC1.27 23.56,28.77 23.88,29.08 23.88,39.88 v24.26,40.26
  Bottom 0.254: v24.26,40.26 24.26,40.64 27.81,44.2 27.81,49.15 28.32,49.66 28.32,60.33 v27.43,61.21
SCK  (via drill 0.61)
  Top 0.254: 14.8,33.34 14.61,33.53 14.35,33.53 IC1.11 | 14.8,33.34 14.86,33.27 14.86,27.94 13.46,26.54 13.46,13.21 14.48,12.19 14.48,11.94 IC7.2 | v22.61,68.96 21.97,68.33 v21.97,56.39 | v5.84,52.07 MP.5 | v20.7,40.51 20.95,40.26 20.95,33.4 14.86,33.4 14.8,33.34
  Bottom 0.254: v22.61,68.96 22.61,70.48 DEV.7 | v5.84,52.07 17.65,52.07 v21.97,56.39 22.23,56.01 23.88,56.01 23.88,44.45 20.7,41.15 v20.7,40.51
SCL  (via drill 0.61)
  Top 0.254: 3.3,67.94 R21.1 | 3.3,67.94 I2C.4 | v7.49,59.94 3.3,59.94 3.3,67.94 | IC1.25 21.98,28.69 21.46,29.21 23.37,31.11 23.37,39.37 v22.48,40.26
  Bottom 0.254: v7.49,59.94 22.61,59.94 24.89,57.66 24.89,43.81 22.48,41.4 v22.48,40.26
SDA  (via drill 0.61)
  Top 0.254: I2C.1 R20.1 | v22.73,29.21 22.73,28.32 IC1.26
  Bottom 0.254: v22.73,29.21 23.11,28.83 27.05,28.83 29.08,26.8 29.08,5.71 24.89,5.71 24,4.83 24,1.91 13.97,1.91 1.4,14.48 1.4,63.88 3.81,63.88 I2C.1
SSFLASH  (via drill 0.61)
  Top 0.254: IC1.30 25.92,26.91 26.29,26.54 26.8,26.54 27.18,26.16 27.18,19.81 26.42,19.05 22.86,19.05 21.46,17.65 21.46,16.51 20.83,15.88 18.41,15.88 R1.1 18.41,14.99 18.92,14.48 18.92,11.94 IC6.2 | IC6.2 19.05,11.43 | v20.07,10.16 19.56,10.16 19.56,10.41 19.18,10.79 19.18,11.05 IC6.2
  Bottom 0.254: v20.07,10.16 20.07,9.27 IC4.1
SSMP  (via drill 0.61)
  Top 0.254: v10.79,57.28 4.95,57.28 MP.9 | IC1.10 13.34,34.42 20.07,34.42 v20.07,38.99
  Bottom 0.254: v10.79,57.28 24,57.28 24.38,56.9 24.38,44.2 21.59,41.27 21.59,39.75 20.83,38.99 v20.07,38.99
T1
  Top 0.254: T1.3 24.77,1.91 26.16,1.91 26.67,2.41 26.67,17.78 28.19,19.3 28.19,28.57 27.94,28.83 26.92,28.83 26.67,28.57 26.67,27.81 26.68,27.8 IC1.31
T2
  Top 0.254: T2.3 23.75,10.16 24.13,10.54 24.13,17.78 24.89,18.54 26.67,18.54 27.69,19.56 27.69,27.56 27.5,27.75 IC1.32
T3  (via drill 0.61)
  Top 0.254: v7.87,27.43 7.87,29.21 8.89,29.21 10.54,30.86 10.54,35.81 13.34,35.81 IC1.8
  Bottom 0.254: v7.87,27.43 7.75,27.3 6.6,27.3 5.71,26.42 5.71,18.29 14.86,18.29 15.37,18.8 21.08,18.8 22.23,17.65 T3.3
TCK  (via drill 0.61)
  Top 0.254: v27.94,41.4 27.56,41.78 21.97,41.78 21.21,42.55 21.21,43.31 IC1.57 | R2.1 19.05,68.07 21.08,66.04 21.08,56.01 22.61,54.48 29.84,54.48 ADC4.3
  Bottom 0.254: ADC4.3 30.48,49.4 29.34,48.26 29.34,42.8 v27.94,41.4
TMS  (via drill 0.61)
  Top 0.254: v30.48,42.42 30.1,42.8 28.45,42.8 27.94,42.29 22.23,42.29 21.97,42.55 21.97,43.31 IC1.56
  Bottom 0.254: v30.48,42.42 ADC5.3 30.48,47.24 31.75,48.51 31.75,60.83 30.48,62.1 27.81,62.1 26.92,62.99 26.92,67.31 26.16,68.07 22.1,68.07 21.59,68.58 21.59,75.82 21.21,76.2 R3.2
TX
  Top 0.254: R18.2 29,66.89 28.19,67.69 28.19,68.96 28.2,68.96 IC2.8 28.22,69.7 27.56,70.36 26.29,70.36 25.91,69.98 24.89,69.98 24.13,70.74 24.13,73.03 23.5,73.66 DEV.8
TX1  (via drill 0.61)
  Top 0.254: R18.1 29,65.19 28.07,64.26 27.69,64.26 27.56,64.14 IC2.12 | IC1.28 24.36,27.81 24.38,27.81 24.38,39.12 v25.53,40.26 | v28.83,61.21 27.56,62.48 IC2.12 | IC2.12
  Bottom 0.254: v25.53,40.26 25.53,41.02 28.32,43.94 28.32,48.9 28.83,49.4 v28.83,61.21
TX_SLAVE  (via drill 0.61)
  Top 0.254: v5.59,55.88 MP.8
  Bottom 0.254: v5.59,55.88 R16.1

### Text on the board
Top: io-2 | 2008
Bottom: APB08
tNames: NoJTAG!